# Altium schematic sheet Sheet1.SchDoc
size A
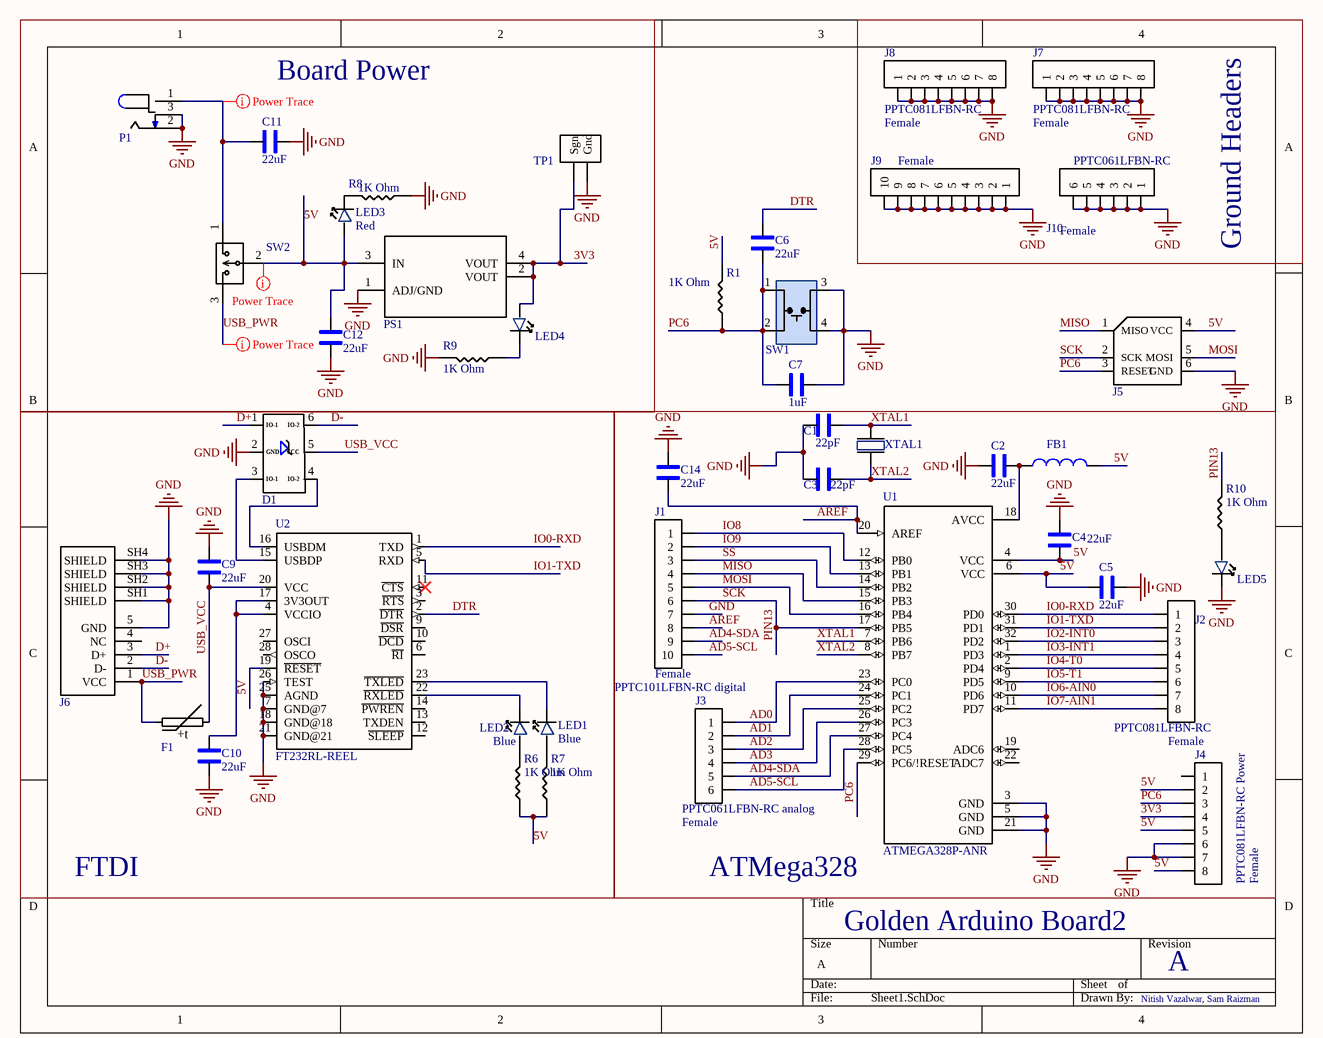
[diagram p0: Sheet1.SchDoc]

## Parts
C1  22pF  [0402_Passive]
C2  22uF  [0603_PASSIVE]
C3  22pF  [0402_Passive]
C4  22uF  [0603_PASSIVE]
C5  22uF  [0603_PASSIVE]
C6  22uF  [0603_PASSIVE]
C7  1uF  [0402_Passive]
C9  22uF  [0603_PASSIVE]
C10  22uF  [0603_PASSIVE]
C11  22uF  [0603_PASSIVE]
C12  22uF  [0603_PASSIVE]
C14  22uF  [0603_PASSIVE]
D1  IP4234CZ6,125  [TVS]  (value not drawn)
F1  MF-MSMF050-2  [FUSE]  (value not drawn)
FB1  FB_300mA_1206  [1206_Passive]  (value not drawn)
J1  PPTC101LFBN-RC digital  value Female  [10_PIN_ARDUINO_100MIL]
J2  PPTC081LFBN-RC  value Female  [8_PIN_ARDUINO_100MIL]
J3  PPTC061LFBN-RC analog  value Female  [6_PIN_ARDUINO_100mil]
J4  PPTC081LFBN-RC Power  value Female  [8_PIN_ARDUINO_100MIL]
J5  NRPN032PAEN-RC  [ICSP]  (value not drawn)
J6  XM7D-0512  [USB_2]  (value not drawn)
J7  PPTC081LFBN-RC  value Female  [8_PIN_ARDUINO_100MIL]
J8  PPTC081LFBN-RC  value Female  [8_PIN_ARDUINO_100MIL]
J9  value Female  [10_PIN_ARDUINO_100MIL]  (hidden comment: PPTC101LFBN-RC)
J10  PPTC061LFBN-RC  value Female  [6_PIN_ARDUINO_100mil]
LED1  value Blue  [LED]  (hidden comment: LTST-C150CKT)
LED2  value Blue  [LED]  (hidden comment: LTST-C150CKT)
LED3  value Red  [LED]  (hidden comment: LTST-C150CKT)
LED4  LTST-C150CKT  [LED]  (value not drawn)
LED5  LTST-C150CKT  [LED]  (value not drawn)
P1  Power Jack  [Power_Jack]  (value not drawn)
PS1  AZ1117CH-3.3TRG1  [LDO]  (value not drawn)
R1  value 1K Ohm  [0402_Passive]  (hidden comment: 1k)
R6  value 1K Ohm  [0402_Passive]  (hidden comment: 1k)
R7  value 1K Ohm  [0402_Passive]  (hidden comment: 1k)
R8  value 1K Ohm  [0402_Passive]  (hidden comment: 1k)
R9  value 1K Ohm  [0402_Passive]  (hidden comment: 1k)
R10  value 1K Ohm  [0402_Passive]  (hidden comment: 1k)
SW1  TL3305AF160QG  [Switch_JLC]  (value not drawn)
SW2  PREC003SAAN-RC  [3_PIN_100mil]  (value not drawn)
TP1  10x Probe TP  [TP10x_Probe]  (value not drawn)
U1  ATMEGA328P-ANR  [ATMega328P]
U2  FT232RL-REEL  [FTDI]
XTAL1  ABLS-16.000MHZ-B4-T  [Crystal]  (value not drawn)

## Blocks framed on the sheet
Board Power: C11 C12 LED3 LED4 P1 PS1 R8 R9 SW2 TP1
Ground Headers: J7-J10
FTDI: C9 C10 D1 F1 J6 LED1 LED2 R6 R7 U2
ATMega328: C1-C5 C14 FB1 J1-J4 LED5 R10 U1 XTAL1

## Nets
GND: C1.1 C2.1 C3.1 C4.2 C5.1 C7.2 C9.2 C10.1 C11.2 C12.1 C14.2 D1.2(GND) J1.7 J4.6 J4.7 J5.6(GND) J6.5(GND) J6.SH1(SHIELD) J6.SH2(SHIELD) J6.SH3(SHIELD) J6.SH4(SHIELD) J7.1 J7.2 J7.3 J7.4 J7.5 J7.6 J7.7 J7.8 J8.1 J8.2 J8.3 J8.4 J8.5 J8.6 J8.7 J8.8 J9.1 J9.2 J9.3 J9.4 J9.5 J9.6 J9.7 J9.8 J9.9 J9.10 J10.1 J10.2 J10.3 J10.4 J10.5 J10.6 LED5.1 P1.2 P1.3 PS1.1(ADJ/GND) R8.1 R9.2 SW1.3 SW1.4 TP1.2(Gnd) U1.3(GND) U1.5(GND) U1.21(GND) U2.7(GND@7) U2.18(GND@18) U2.21(GND@21) U2.25(AGND) U2.26(TEST)
3V3: J4.4 LED4.2 PS1.2(VOUT) PS1.4(VOUT) TP1.1(Sgn)
5V: C4.1 C5.2 C12.2 FB1.2 J4.2 J4.5 J4.8 J5.4(VCC) LED3.2 PS1.3(IN) R1.2 R6.1 R7.1 SW2.2 U1.4(VCC) U1.6(VCC) U2.19(~{RESET})
AD0: J3.1 U1.23(PC0)
AD1: J3.2 U1.24(PC1)
AD2: J3.3 U1.25(PC2)
AD3: J3.4 U1.26(PC3)
AD4-SDA: J1.9 J3.5 U1.27(PC4)
AD5-SCL: J1.10 J3.6 U1.28(PC5)
AREF: C14.1 J1.8 U1.20(AREF)
D+: D1.1(IO-1) J6.3(D+)
D-: D1.6(IO-2) J6.2(D-)
DTR: C6.2 U2.2(~{DTR})
IO0-RXD: J2.1 U1.30(PD0) U2.1(TXD)
IO1-TXD: J2.2 U1.31(PD1) U2.5(RXD)
IO2-INT0: J2.3 U1.32(PD2)
IO3-INT1: J2.4 U1.1(PD3)
IO4-T0: J2.5 U1.2(PD4)
IO5-T1: J2.6 U1.9(PD5)
IO6-AIN0: J2.7 U1.10(PD6)
IO7-AIN1: J2.8 U1.11(PD7)
IO8: J1.1 U1.12(PB0)
IO9: J1.2 U1.13(PB1)
MISO: J1.4 J5.1(MISO) U1.15(PB3)
MOSI: J1.5 J5.5(MOSI) U1.16(PB4)
PC6: C6.1 C7.1 J4.3 J5.3(RESET) R1.1 SW1.1 SW1.2 U1.29(PC6/!RESET)
PIN13: J1.6 J5.2(SCK) R10.2 U1.17(PB5)  [also labelled SCK]
SS: J1.3 U1.14(PB2)
USB_PWR: F1.1 J6.1(VCC) SW2.3
USB_VCC: C9.1 D1.5(VCC) F1.2 U2.20(VCC)
XTAL1: C1.2 U1.7(PB6) XTAL1.2
XTAL2: C3.2 U1.8(PB7) XTAL1.1
NetC2_2: C2.2 FB1.1 U1.18(AVCC)
NetC10_2: C10.2 U2.4(VCCIO) U2.17(3V3OUT)
NetC11_1: C11.1 P1.1 SW2.1
NetD1_3: D1.3(IO-1) U2.15(USBDP)
NetD1_4: D1.4(IO-2) U2.16(USBDM)
NetLED1_1: LED1.1 U2.23(~{TXLED})
NetLED1_2: LED1.2 R7.2
NetLED2_1: LED2.1 U2.22(~{RXLED})
NetLED2_2: LED2.2 R6.2
NetLED3_1: LED3.1 R8.2
NetLED4_1: LED4.1 R9.1
NetLED5_2: LED5.2 R10.1

Not connected (* = marked no-connect by the designer): J4 1; J6 4(NC); U1 19(ADC6) 22(ADC7); U2 3(~{RTS}) 6(~{RI}) 9(~{DSR}) 10(~{DCD}) 11(~{CTS})* 12(~{SLEEP}) 13(TXDEN) 14(~{PWREN}) 27(OSCI) 28(OSCO)

## Layout directives
rule Width Constraint [Pref Width = 20mil    Min Width = 10mil    Max Width = 100mil]: 5V, NetC11_1, USB_PWR

## Notes on the sheet
- Golden Arduino Board2
- A
- Nitish Vazalwar, Sam Raizman
- (in symbol F_Polyswitch_500mA) +t

## Library data of the parts
C1 C3 = C_22pF_0402: MULTILAYER CERAMIC CAPACITORS MLCC - SMD/SMT 22PF 50V 0402 ROHS; MFR Part #: 0402CG220J500NT; Type: Basic; Datasheet: https://datasheet.lcsc.com/szlcsc/Guangdong-Fenghua-Advanced-Tech-0402CG220J500NT_C1555.pdf; LCSC Part#: C1555; Value: 22pF
C2 C4-C6 C9-C12 C14 = C_22uF_0603: MULTILAYER CERAMIC CAPACITORS MLCC - SMD/SMT 22UF 6.3V 0603 ROHS; MFR Part #: CL10A226MQ8NRNC; Type: Basic; Datasheet: https://datasheet.lcsc.com/szlcsc/Samsung-Electro-Mechanics-CL10A226MQ8NRNC_C59461.pdf; LCSC Part#: C59461; Value: 22uF
C7 = C_1uF_0402: MULTILAYER CERAMIC CAPACITORS MLCC - SMD/SMT 1UF 25V 0402 ROHS; MFR Part #: CL05A105KA5NQNC; Type: Basic; Datasheet: https://datasheet.lcsc.com/szlcsc/Samsung-Electro-Mechanics-CL05A105KA5NQNC_C52923.pdf; LCSC Part#: C52923; Value: 1uF
D1 = D_TVS_Diode: Clamp Ipp Tvs Diode Surface Mount 6-TSOP; Value: TVS DIODE 5.5V 6TSOP; Type: Extended; Digikey Part: 1727-4717-1-ND; Digikey Link: https://www.digikey.com/product-detail/en/IP4234CZ6%2c125/1727-4717-1-ND/2531156/?itemSeq=304982369; MFR Part #: IP4234CZ6,125; LCSC Part#: C455086
F1 = F_Polyswitch_500mA: Polymeric PTC Resettable Fuse 15V 500mA Ih Surface Mount 1812 (4532 Metric), Concave; MFR Part #: SMD1812P050TF; Value: PTC RESET FUSE 15V 500MA 1812; Type: Extended; Digikey Link: https://www.digikey.com/product-detail/en/MF-MSMF050-2/MF-MSMF050-2CT-ND/662842/?itemSeq=304982360; Digikey Part: MF-MSMF050-2CT-ND; LCSC Part#: C12558
FB1 = FB_300mA_1206: Ferrite Bead. 2 kOhms @ 30MHz, 500mOhm; MFR Part #: NA; DigiKey Link: https://www.digikey.com/product-detail/en/laird-signal-integrity-products/HZ1206C202R-10/240-2413-1-ND/806773
J1 J9 = JF_10_PIN_FEMALE_ARDUINO: 10 Position Header Connector 0.100" (2.54mm) Through Hole Tin; Digikey Link: https://www.digikey.com/product-detail/en/PPTC101LFBN-RC/S7008-ND/810149/?itemSeq=304982352; Digikey Part: S7008-ND
J2 J4 J7 J8 = JF_8_PIN_FEMALE_ARDUINO: 8 Position Header Connector 0.100" (2.54mm) Through Hole Tin; Digikey Link: https://www.digikey.com/product-detail/en/PPTC081LFBN-RC/S7006-ND/810147/?itemSeq=304982354; Digikey Part: S7006-ND
J3 J10 = JF_6_PIN_FEMALE_ARDUINO: 6 Position Header Connector 0.100" (2.54mm) Through Hole Tin; Digikey Link: https://www.digikey.com/product-detail/en/PPTC061LFBN-RC/S7004-ND/810145/?itemSeq=304982353; Digikey Part: S7004-ND
J5 = J_ICSP: Connector Header Through Hole 6 position 0.079" (2.00mm); Digikey Link: https://www.digikey.com/product-detail/en/NRPN032PAEN-RC/S5801-03-ND/804955/?itemSeq=304982355; Digikey Part: S5801-03-ND; Value: NRPN032PAEN-RC
J6 = J_USB_2_B_Mini: USB - mini B USB 2.0 Receptacle Connector 5 Position Through Hole, Right Angle; Value: CONN RCPT USB2.0 MINI B 5P R/A; Digikey Link: https://www.digikey.com/product-detail/en/XM7D-0512/OR1205-ND/4695531/?itemSeq=304982356; Digikey Part: OR1205-ND
LED1 LED2 = LED_BLUE_1206: Blue LED Indicator
LED3 = LED_RED_1206: Red 638nm LED Indication - Discrete 1.8V 1206 (3216 Metric); Digikey Link: https://www.digikey.com/product-detail/en/LTST-C150CKT/160-1167-1-ND/269239/?itemSeq=304982368; Digikey Part: 160-1167-1-ND
LED4 LED5 = LED_GREEN_1206: Green LED Indicator
P1 = P_Power Jack: Power Barrel Connector Jack 2.10mm ID (0.083"), 5.50mm OD (0.217") Through Hole, Right Angle; Value: CONN PWR JACK 2X5.5MM SOLDER; Digikey Link: https://www.digikey.com/product-detail/en/PJ-102A/CP-102A-ND/275425/?itemSeq=304982367; Digikey Part: CP-102A-ND
PS1 = PS_LDO_3v3: Linear Voltage Regulator IC Positive Fixed 1 Output 1A SOT-223; MFR Part #: AZ1117CH2-3.3TRG1; Value: IC REG LINEAR 3.3V 800MA SOT223; Digikey Link: https://www.digikey.com/product-detail/en/AZ1117CH-3.3TRG1/AZ1117CH-3.3TRG1DICT-ND/4505206/?itemSeq=304982370; Digikey Part: AZ1117CH-3.3TRG1DICT-ND; LCSC Part#: C108492; Type: Extended
R1 R6-R10 = R_1K_0402: 1 kOhms chip resistor SURFACE MOUNT 1KOHMS ±1% 1/16W 0402 ROHS; MFR Part #: 0402WGF1001TCE; Datasheet: https://datasheet.lcsc.com/szlcsc/Uniroyal-Elec-0402WGF1001TCE_C11702.pdf; LCSC Part#: C11702; Type: Basic
SW1 = SW_Push_Button_JLC: Tactile Switch SPST-NO Top Actuated Surface Mount; MFR Part #: UK-B0228-G5-160-JZ; Value: SWITCH TACTILE SPST-NO 50MA 12V; Digikey Link: https://www.digikey.com/product-detail/en/TL3305AF160QG/EG5350CT-ND/5816195/?itemSeq=304982361; Digikey Part: EG5350CT-ND; LCSC Part#: C620316; Type: Basic
SW2 = SW_3Pin_100mil_Switch: Connector Header Through Hole 3 position 0.100" (2.54mm); Value: CONN HEADER VERT 3POS 2.54MM; Digikey Link: https://www.digikey.com/product-detail/en/PREC003SAAN-RC/S1012EC-03-ND/2774851/?itemSeq=304982371; Digikey Part: S1012EC-03-ND
TP1 = TP_10x_Probe: Test Point 300 mil centers
U1 = U_ATMega328P: AVR AVR® ATmega Microcontroller IC 8-Bit 20MHz 32KB (16K x 16) FLASH 32-TQFP (7x7); MFR Part #: ATMEGA328P-AU; Value: IC MCU 8BIT 32KB FLASH 32TQFP; Digikey Link: https://www.digikey.com/product-detail/en/ATMEGA328P-ANR/ATMEGA328P-ANRCT-ND/2774230/?itemSeq=304982365; LCSC Part#: C14877; Type: Basic
U2 = U_FTDI232: USB Bridge, USB to UART USB 2.0 UART Interface 28-SSOP; Value: IC USB FS SERIAL UART 28-SSOP; Digikey Link: https://www.digikey.com/product-detail/en/FT232RL-REEL/768-1007-1-ND/1836402/?itemSeq=304982359; Digikey Part: 768-1007-1-ND; MFR Part #: FT232RL-REEL; LCSC Part#: C8690; Type: Basic
XTAL1 = XTAL_16MHz: 16MHz ±30ppm Crystal 18pF 40 Ohms HC-49/US. Use for ECEN 4/5730 Arduino; Value: CRYSTAL 16.0000MHZ 18PF SMD; Digikey Link: https://www.digikey.com/product-detail/en/ABLS-16.000MHZ-B4-T/535-10226-1-ND/2184261/?itemSeq=304982364; Digikey Part: 535-10226-1-ND; JLC Part Number: *